# Altium schematic sheet p1_structure.SchDoc
size A4; Organization: ORGANIZATION; Address1: ADDRESS 1; Address2: ADDRESS 2; Address3: ADDRESS 3; Address4: ADDRESS 4; Revision: Rev. A; ENG_APP_DATE: --/--/--; DSN_APP_DATE: --/--/--; CHK_APP_DATE: --/--/--
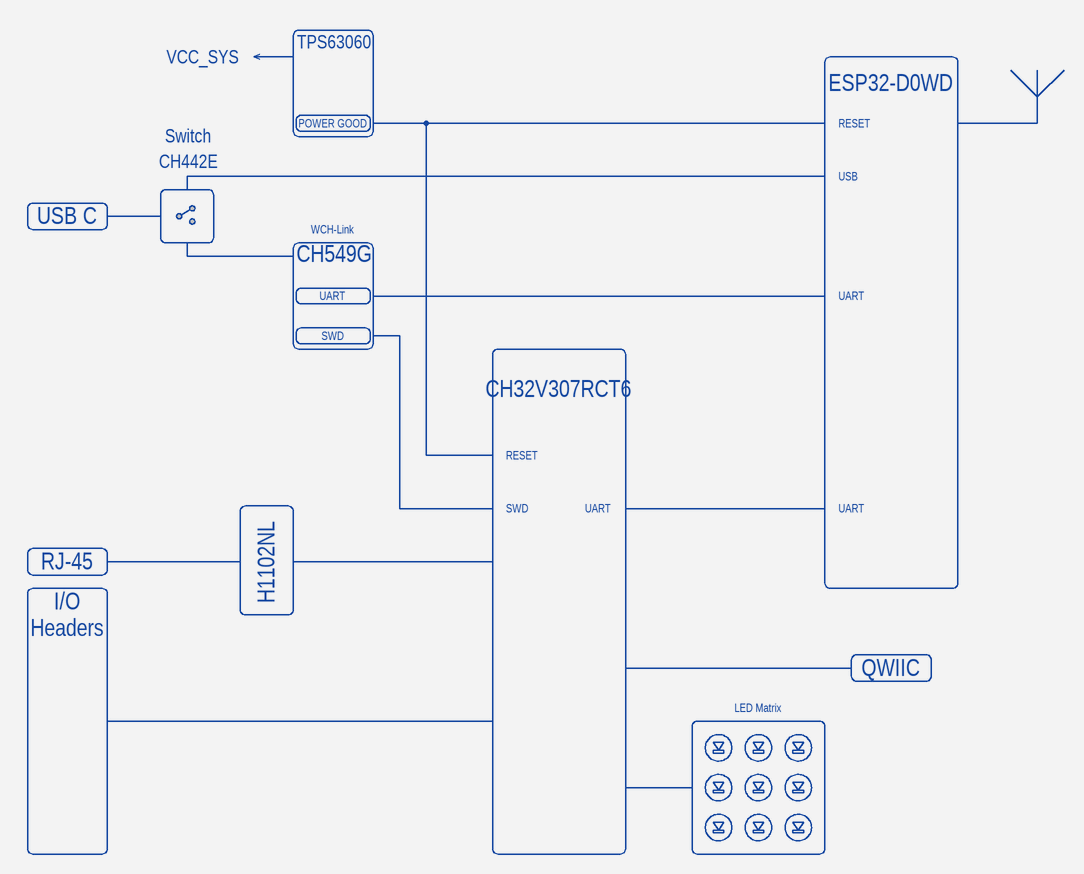
[diagram p0: p1_structure.SchDoc]

## Notes on the sheet
- VCC_SYS
- TPS63060
- POWER GOOD
- RESET
- ESP32-D0WD
- Switch
- CH442E
- USB
- USB C
- WCH-Link
- CH549G
- UART
- SWD
- CH32V307RCT6
- RJ-45
- I/O
- H1102NL
- Headers
- QWIIC
- LED Matrix
- A4
- GitHub <https://github.com/kirra-cat/druino-uno>
- view on